# EAGLE design AskelmoottoriV3 (EAGLE 9.4.0)
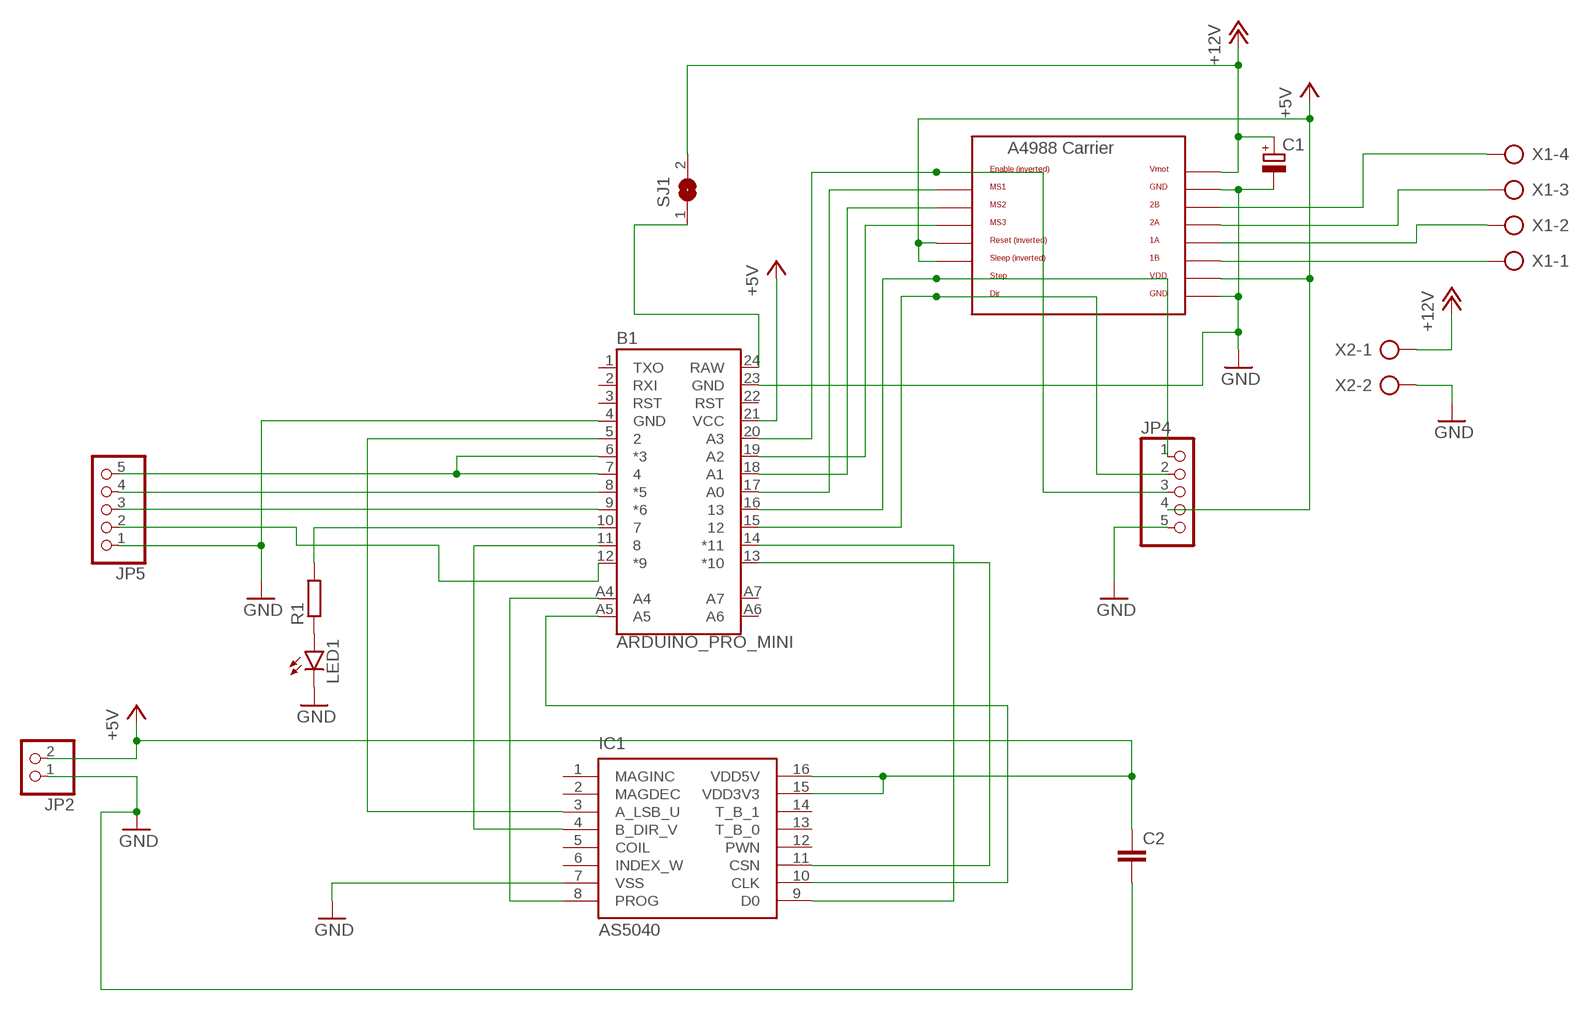
[diagram p0: schematic, sheet 1]

## Parts
B1  ARDUINO_PRO_MINI  [ARDUINO_PRO_MINI]
C1  CPOL-EUE5-8.5  [E5-8,5]
C2  C-EU025-030X050  [C025-030X050]
IC1  AS5040  [SSOP16]
JP2  PINHD-1X2  [1X02]
JP4  PINHD-1X5  [1X05]
JP5  PINHD-1X5  [1X05]
LED1  LED3MM  [LED3MM]
R1  R-EU_0207/10  [0207/10]
SJ1  SJ  [SJ]
U$1  A4988BREAKOUT  [A4988BREAKOUT]
X1  AK300/4  [AK300/4]
X2  AK300/2  [AK300/2]

## Nets
+5V: B1.21(VCC) C2.1 IC1.15(VDD3V3) IC1.16(VDD5V) JP2.2 JP4.4 U$1.RST U$1.SLP(SLEEP) U$1.VDD
+12V: C1.+ SJ1.2 U$1.VMOT X2.1
GND: B1.4(GND) B1.23(GND) C1.- C2.2 IC1.7(VSS) JP2.1 JP4.5 JP5.1 LED1.K(C) U$1.GND U$1.GND@0(GND) X2.2
N$1: U$1.2B X1.4
N$2: U$1.2A X1.3
N$3: U$1.1A X1.2
N$4: U$1.1B X1.1
N$5: B1.17(A0) U$1.MS1
N$6: B1.18(A1) U$1.MS2
N$7: B1.19(A2) U$1.MS3
N$8: B1.20(A3) JP4.3 U$1.EN
N$9: B1.5 IC1.3(A_LSB_U)
N$10: B1.16 JP4.1 U$1.STEP
N$11: B1.15 JP4.2 U$1.DIR
N$12: B1.11 IC1.4(B_DIR_V)
N$13: B1.6(*3) B1.7 JP5.5
N$14: B1.24(RAW) SJ1.1
N$15: B1.A5 IC1.10(CLK)
N$16: B1.A4 IC1.8(PROG)
N$17: B1.13(*10) IC1.11(CSN)
N$18: B1.8(*5) JP5.4
N$19: B1.9(*6) JP5.3
N$20: LED1.A R1.1
N$21: B1.10 R1.2
N$22: B1.12(*9) JP5.2
N$23: B1.14(*11) IC1.9(D0)
Unconnected: B1.1(TXO) B1.2(RXI) B1.3(RST) B1.22(RST) B1.A6 B1.A7 IC1.1(MAGINC) IC1.2(MAGDEC) IC1.5(COIL) IC1.6(INDEX_W) IC1.12(PWN) IC1.13(T_B_0) IC1.14(T_B_1)

## Library data of the parts
B1 = SparkFun-Boards:ARDUINO_PRO_MINI: SparkFun Pro Mini Pro Mini compatible footprint. Dimensions: 0.7 x 1.3" PCB Thickness: 0.8mm SparkFun Products: 3.3V/8MHz <https://www.sparkfun.com/products/11114> 5V/16MHz <https://www.sparkfun.com/products/11113>
C1 = rcl:CPOL-EU: POLARIZED CAPACITOR, European symbol; SPICEPREFIX: C
C2 = rcl:C-EU: CAPACITOR, European symbol; SPICEPREFIX: C
IC1 = austriamicrosystems:AS5040: 10-BIT PROGRAMMABLE MAGNETIC ROTARY ENCODER Source: www.austriamicrosystems.com .. AS5040DataSheetRev12.pdf; MPN: AS5040ASSU; OC_FARNELL: 1630800; OC_NEWARK: 59P4059
JP2 = pinhead:PINHD-1X2: PIN HEADER
JP4 JP5 = pinhead:PINHD-1X5: PIN HEADER
LED1 = led:LED: LED OSRAM: - CHIPLED LG R971, LG N971, LY N971, LG Q971, LY Q971, LO R971, LY R971 LH N974, LH R974 LS Q976, LO Q976, LY Q976 LO Q996 - Hyper CHIPLED LW Q18S LB Q993, LB Q99A, LB R99A - SideLED LS A670, LO A670, LY A670, LG A670, LP A670 LB A673, LV A673, LT A673, LW A673 LH A674 LY A675 LS A676, LA A676, LO A676, LY A676, LW A676 LS A679, LY A679, LG A679 - Hyper Micro SIDELED® LS Y876, LA Y876, LO Y876, LY Y876 LT Y87S - SmartLED LW L88C, LW L88S LB L89C, LB L89S, LG L890 LS L89K, LO L89K, LY L89K LS L896, LA L896, LO L896, LY L896 - TOPLED LS T670, LO T670, LY T670, LG T670, LP T670 LSG T670, LSP T670, LSY T670, LOP T670, LYG T670 LG T671, LOG T671, LSG T671 LB T673, LV T673, LT T673, LW T673 LH T674 LS T676, LA T676, LO T676, LY T676, LB T676, LH T676, LSB T676, LW T676 LB T67C, LV T67C, LT T67C, LS T67K, LO T67K, LY T67K, LW E67C LS E67B, LA E67B, LO E67B, LY E67B, LB E67C, LV E67C, LT E67C LW T67C LS T679, LY T679, LG T679 LS T770, LO T770, LY T770, LG T770, LP T770 LB T773, LV T773, LT T773, LW T773 LH T774 LS E675, LA E675, LY E675, LS T675 LS T776, LA T776, LO T776, LY T776, LB T776 LHGB T686 LT T68C, LB T68C - Hyper Mini TOPLED® LB M676 - Mini TOPLED Santana® LG M470 LS M47K, LO M47K, LY M47K Source: http://www.osram.convergy.de LUXEON: - LUMILED® LXK2-PW12-R00, LXK2-PW12-S00, LXK2-PW14-U00, LXK2-PW14-V00 LXK2-PM12-R00, LXK2-PM12-S00, LXK2-PM14-U00 LXK2-PE12-Q00, LXK2-PE12-R00, LXK2-PE12-S00, LXK2-PE14-T00, LXK2-PE14-U00 LXK2-PB12-K00, LXK2-PB12-L00, LXK2-PB12-M00, LXK2-PB14-N00, LXK2-PB14-P00, LXK2-PB14-Q00 LXK2-PR12-L00, LXK2-PR12-M00, LXK2-PR14-Q00, LXK2-PR14-R00 LXK2-PD12-Q00, LXK2-PD12-R00, LXK2-PD12-S00 LXK2-PH12-R00, LXK2-PH12-S00 LXK2-PL12-P00, LXK2-PL12-Q00, LXK2-PL12-R00 Source: www.luxeon.com KINGBRIGHT: KA-3528ASYC Source: www.kingbright.com
R1 = rcl:R-EU_: RESISTOR, European symbol; SPICEPREFIX: R
SJ1 = jumper:SJ: SMD solder JUMPER
U$1 = RepRapjr:A4988BREAKOUT
X1 = con-ptr500:AK300/4: CONNECTOR; OC_FARNELL: unknown; OC_NEWARK: unknown
X2 = con-ptr500:AK300/2: CONNECTOR; OC_FARNELL: unknown; OC_NEWARK: unknown

## Board
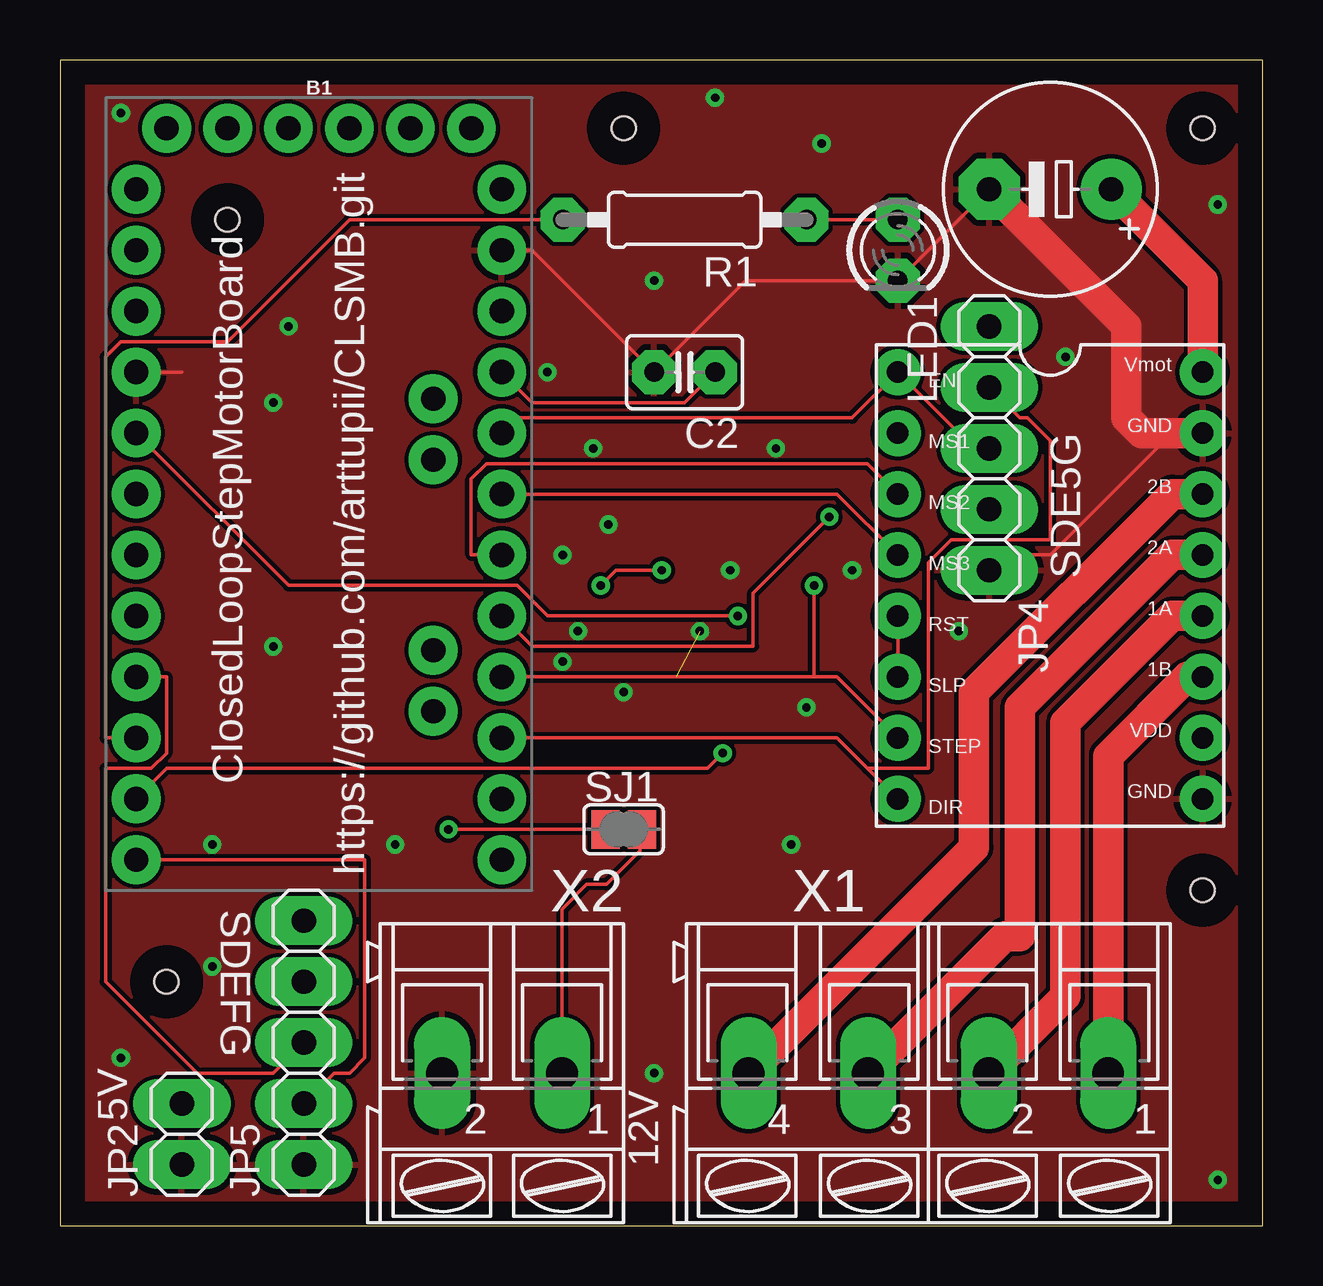
[diagram p1: board, top side]
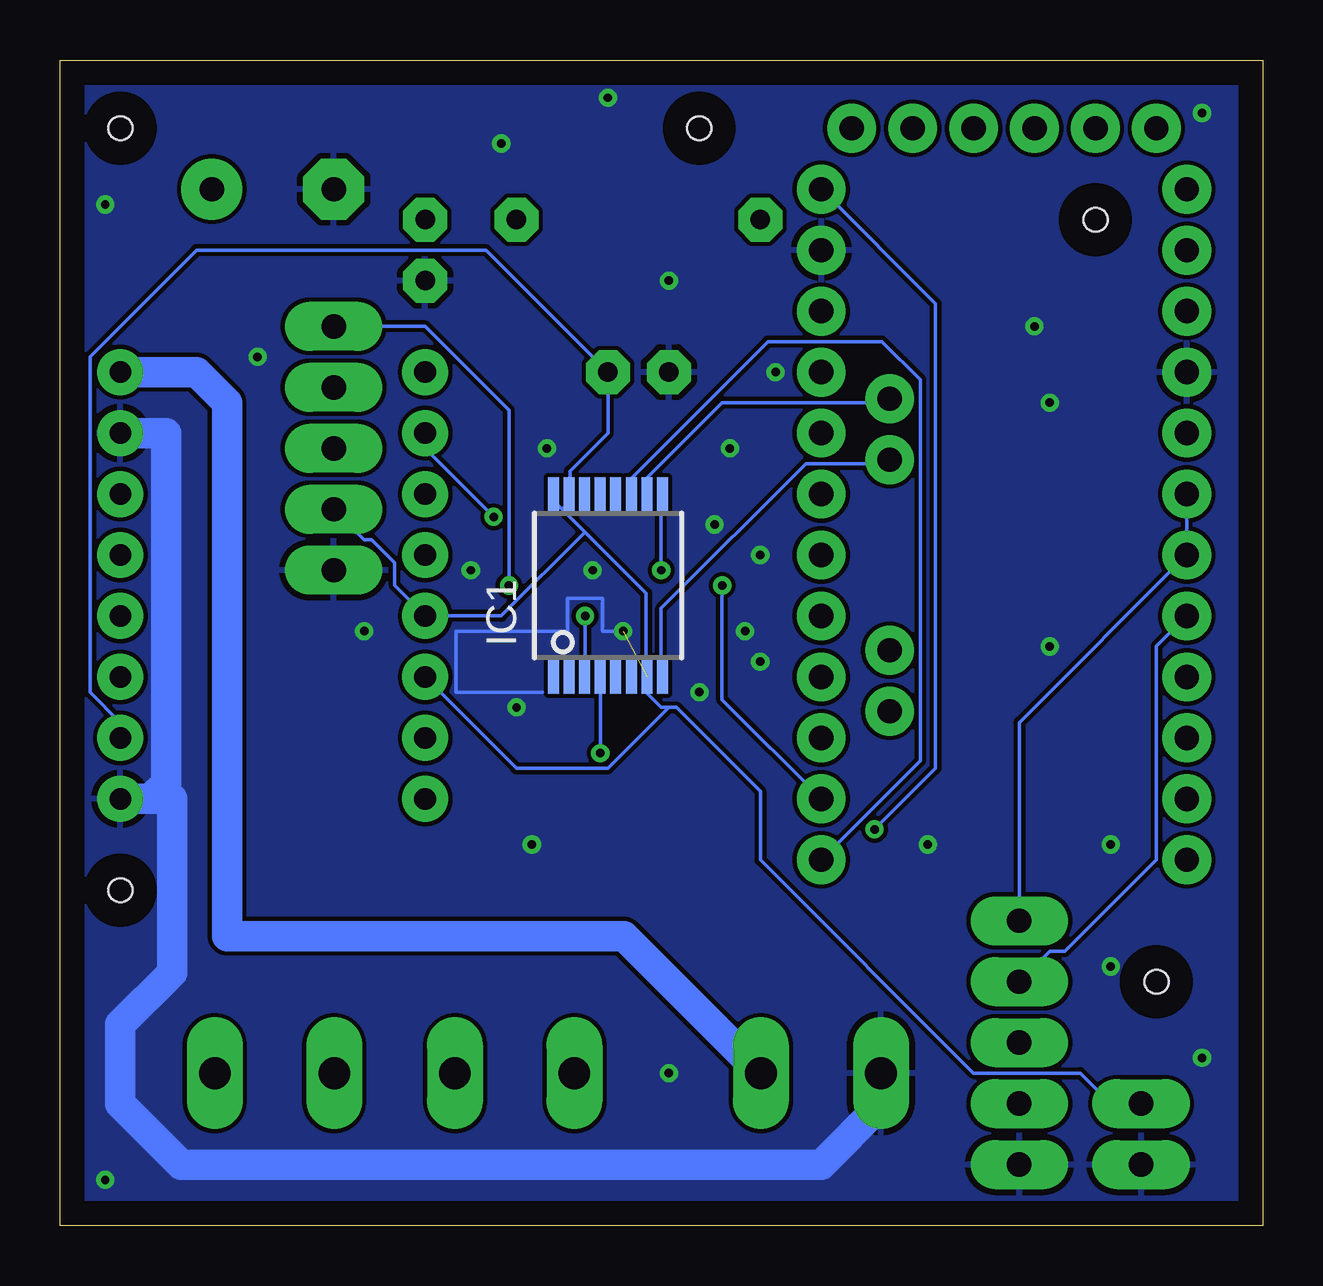
[diagram p2: board, bottom side, seen from below]

Size 50.14 x 48.56 mm. Coordinates in mm from the lower left corner, seen from the top.
Outline: 0,0 50.14,0 50.14,48.56 0,48.56 0,0
Copper layers (1*16): Top 0.035mm / dielectric 1.5mm / Bottom 0.035mm
Design rules "default *": minimum track width 6mil, minimum drill 0.35mm, track to track 7mil, track to pad 6mil, pad to pad 6mil, via to via 6mil, smd to smd 6mil, copper to edge 40mil, drill to drill 6mil, minimum pad ring 20mil, minimum via ring 8mil, stop-mask expansion 4mil, vias tented up to drill 0mil, thermal gap 10mil
Holes 1 mm at 47.62,45.72 47.62,13.97 4.45,10.16 23.5,45.72 6.98,41.91

### Footprints (pad centres in the part's own frame; a part is rotated, then mirrored left to right if it is on the bottom)
ARDUINO_PRO_MINI = drill 1.016 pad 1.88: 1 -7.62,12.7; 2 -7.62,10.16; 3 -7.62,7.62; 4 -7.62,5.08; 5 -7.62,2.54; 6 -7.62,0; 7 -7.62,-2.54; 8 -7.62,-5.08; 9 -7.62,-7.62; 10 -7.62,-10.16; 11 -7.62,-12.7; 12 -7.62,-15.24; 13 7.62,-15.24; 14 7.62,-12.7; 15 7.62,-10.16; 16 7.62,-7.62; 17 7.62,-5.08; 18 7.62,-2.54; 19 7.62,0; 20 7.62,2.54; 21 7.62,5.08; 22 7.62,7.62; 23 7.62,10.16; 24 7.62,12.7; A4 4.763,1.429; A5 4.763,3.969; A6 4.763,-9.049; A7 4.763,-6.509; BLK -6.35,15.24; GND -3.81,15.24; GRN 6.35,15.24; RXI 1.27,15.24; TXO 3.81,15.24; VCC -1.27,15.24
E5-8,5 = drill 1.016 pad 2.54: + -2.54,0 | drill 1.016 pad 2.54 octagon: - 2.54,0
C025-030X050 = drill 0.813 octagon: 1 -1.27,0; 2 1.27,0
SSOP16 = smd 0.46 x 1.43: 1 -2.275,-3.795; 2 -1.625,-3.795; 3 -0.975,-3.795; 4 -0.325,-3.795; 5 0.325,-3.795; 6 0.975,-3.795; 7 1.625,-3.795; 8 2.275,-3.795; 9 2.275,3.795; 10 1.625,3.795; 11 0.975,3.795; 12 0.325,3.795; 13 -0.325,3.795; 14 -0.975,3.795; 15 -1.625,3.795; 16 -2.275,3.795
1X02 = drill 1.016 long: 1 -1.27,0; 2 1.27,0
1X05 = drill 1.016 long: 1 -5.08,0; 2 -2.54,0; 3 0,0; 4 2.54,0; 5 5.08,0
LED3MM = drill 0.813 octagon: A -1.27,0; K 1.27,0
0207/10 = drill 0.813 octagon: 1 -5.08,0; 2 5.08,0
SJ = smd 1.168 x 1.6: 1 -0.762,0; 2 0.762,0
A4988BREAKOUT = drill 0.9: 1A 8.89,1.27; 1B 11.43,1.27; 2A 6.35,1.27; 2B 3.81,1.27; DIR 16.51,-11.43; EN -1.27,-11.43; GND 16.51,1.27; GND@0 1.27,1.27; MS1 1.27,-11.43; MS2 3.81,-11.43; MS3 6.35,-11.43; RST 8.89,-11.43; SLP 11.43,-11.43; STEP 13.97,-11.43; VDD 13.97,1.27; VMOT -1.27,1.27
AK300/4 = drill 1.321 long: 1 -7.493,0; 2 -2.515,0; 3 2.515,0; 4 7.493,0
AK300/2 = drill 1.321 long: 1 -2.515,0; 2 2.489,0

### Placement (x,y rotation side)
B1  10.79,30.48 0 top
C1  41.27,43.18 180 top
C2  26.04,35.56 180 top
IC1  27.31,26.67 0 bottom
JP2  5.08,3.81 90 top
JP4  38.73,32.38 270 top
JP5  10.16,7.62 90 top
LED1  34.92,40.64 270 top
R1  26.04,41.91 180 top
SJ1  23.5,16.51 0 top
U$1  46.35,34.29 270 top
X1  36.2,6.35 180 top
X2  18.42,6.35 180 top

### Tracks (layer width: path | path; a pad name or v marks a point on that pad's centre or on a via)
+5V
  Top 0.152: U$1.RST U$1.SLP | B1.21 19.69,34.29 26.04,34.29 C2.1
  Bottom 0.152: JP4.4 37.46,28.57 37.15,28.57 36.2,27.62 36.2,26.67 U$1.RST 31.75,25.4 28.26,28.89 | 25.72,23.18 25.72,26.35 28.26,28.89 | 29.21,29.84 29.53,30.16 IC1.16 | 29.21,29.84 28.26,28.89 | 29.21,29.84 28.89,30.16 IC1.15 28.89,30.48 28.89,31.43 27.31,33.02 C2.1 32.38,40.64 44.45,40.64 48.89,36.2 48.89,22.23 47.62,20.95 U$1.VDD | 24.77,21.59 25.08,21.59 25.72,22.23 25.72,22.86 | 24.77,21.59 24.45,21.59 20.96,18.1 20.96,15.24 12.06,6.35 7.62,6.35 6.35,5.08 JP2.2 | 24.77,21.59 27.31,19.05 31.12,19.05 U$1.SLP
+12V
  Top 0.152: X2.1 20.93,13.18 21.96,14.21 22.78,14.21 24.18,15.62 24.18,16.43 SJ1.2
  Top 1.27: C1.+ 47.62,39.37 U$1.VMOT
  Bottom 0.152: 24.77,10.79 25.07,10.49
  Bottom 1.27: X2.1 25.07,10.49 26.65,12.06 43.18,12.06 43.18,34.29 44.45,35.56 U$1.VMOT
GND  (via drill 0.35)  (1 unrouted)
  Top 0.152: B1.23 19.69,40.64 C2.2 28.58,39.37 LED1.K C1.- | 5.08,35.56 B1.4 | JP4.5 39.37,27.94 41.27,27.94 46.04,32.7 46.04,33.02
  Top 1.27: C1.- 44.45,37.47 44.45,33.66 45.09,33.02 46.04,33.02 U$1.GND@0
  Bottom 0.152: v26.67,24.77 27.52,24.77 27.52,26.13 28.99,26.13 28.99,24.77 33.64,24.77 33.64,22.23 30.04,22.23
  Bottom 1.27: U$1.GND@0 45.72,33.02 45.72,18.41 46.35,17.78 U$1.GND 45.47,17.78 45.47,10.54 47.62,8.39 47.62,5.08 45.09,2.54 18.42,2.54 15.93,5.03 X2.2
  other vias: 9.53,37.47 8.89,34.29 8.89,24.13 6.35,15.88 6.35,10.79 13.97,15.88 30.48,15.88 48.26,42.55 31.75,45.09 2.54,6.99 48.26,1.91 27.31,46.99 2.54,46.35 24.77,39.37 20.96,27.94 22.86,29.21 27.94,27.3 22.23,32.38 29.85,32.38 24.77,6.35 37.46,24.77 41.91,36.2 31.12,21.59 23.5,22.23 20.96,23.5 21.59,24.77 33.02,27.3 20.32,35.56
  pour Top: 0.64,48.26 0.64,0.64 48.89,0.64 49.53,1.27 49.53,47.62 48.89,48.26
  pour Bottom: 0.64,48.26 0.64,0.64 48.89,0.64 49.53,1.27 49.53,47.62 48.89,48.26
N$1
  Top 1.27: X1.4 38.1,15.75 38.1,22.23 46.35,30.48 U$1.2B
N$2
  Top 1.27: X1.3 39.39,12.06 40,12.06 40,21.59 46.35,27.94 U$1.2A
N$3
  Top 1.27: X1.2 41.91,9.55 41.91,20.95 46.35,25.4 U$1.1A
N$4
  Top 1.27: X1.1 43.69,19.56 46.99,22.86 U$1.1B
N$5  (via drill 0.35)
  Top 0.152: v32.07,29.53 28.89,26.35 28.89,24.13 19.69,24.13 B1.17
  Bottom 0.152: U$1.MS1 34.92,32.38 v32.07,29.53
N$6
  Top 0.152: U$1.MS2 33.66,31.75 17.78,31.75 17.15,31.11 17.15,27.94 B1.18
N$7
  Top 0.152: U$1.MS3 32.38,30.48 B1.19
N$8
  Top 0.152: JP4.3 38.1,32.38 U$1.EN 33.02,33.66 19.05,33.66 B1.20
N$9  (via drill 0.35)
  Top 0.152: v28.26,25.4 20.32,25.4 19.05,26.67 9.53,26.67 B1.5
  Bottom 0.152: v28.26,25.4 28.26,23.18 IC1.3
N$10  (via drill 0.35)
  Top 0.152: U$1.STEP 32.38,22.86 31.43,22.86 | B1.16 31.43,22.86 | 31.43,22.86 v31.43,26.67
  Bottom 0.152: JP4.1 34.92,37.47 31.43,33.97 v31.43,26.67
N$11
  Top 0.152: 33.66,19.05 32.38,20.32 B1.15 | 33.66,19.05 U$1.DIR | JP4.2 40,33.66 40.32,33.66 41.27,32.7 41.27,28.57 37.15,28.57 36.2,27.62 36.2,19.05 33.66,19.05
N$12  (via drill 0.35)
  Top 0.152: v27.62,19.68 26.99,19.05 4.45,19.05 B1.11
  Bottom 0.152: v27.62,19.68 27.62,22.86 IC1.4
N$13
  Bottom 0.152: JP5.5 10.16,20.95 B1.7 B1.6
N$14  (via drill 0.35)
  Top 0.152: SJ1.1 v16.19,16.51
  Bottom 0.152: v16.19,16.51 13.65,19.05 13.65,38.42 B1.24
N$15
  Bottom 0.152: IC1.10 25.72,30.48 25.72,31.11 22.54,34.29 15.56,34.29 B1.A5
N$16
  Bottom 0.152: IC1.8 25.08,23.18 25.08,25.72 19.05,31.75 15.56,31.75 B1.A4
N$17
  Bottom 0.152: B1.13 14.29,19.37 14.29,35.24 15.88,36.83 20.64,36.83 26.35,31.11 26.35,30.48 IC1.11
N$18
  Bottom 0.152: JP5.4 8.89,11.43 8.26,11.43 4.45,15.24 4.45,24.13 B1.8
N$19
  Top 0.152: B1.9 4.45,22.86 4.45,19.68 3.81,19.05 1.91,19.05 1.91,10.16 5.71,6.35 8.89,6.35 JP5.3
N$20
  Top 0.152: LED1.A R1.1
N$21
  Top 0.152: R1.2 12.06,41.91 6.98,36.83 2.54,36.83 1.91,36.2 1.91,20.32 B1.10
N$22
  Top 0.152: JP5.2 11.43,6.35 12.06,6.35 12.7,6.99 12.7,15.24 B1.12
N$23  (via drill 0.35)
  Top 0.152: v25.08,27.3 23.18,27.3 v22.54,26.67
  Bottom 0.152: v25.08,27.3 25.08,30.16 IC1.9 | v22.54,26.67 22.54,21.91 B1.14

### Text on the board
tPlace: SDE5G | ClosedLoopStepMotorBoard | https://github.com/arttupii/CLSMB.git | SDEFG | 5V | 12V
tValues: ClosedLoopStepMotorBoard 0.12 | https://github.com/arttupii/CLSMB.git